# Altium schematic sheet Barrier_SchematicV2.SchDoc: Barrier Prj.
size A4; CompanyName: Pasargad-Barrier_Prj; Engineer: Pouya_Mn; Revision: 2
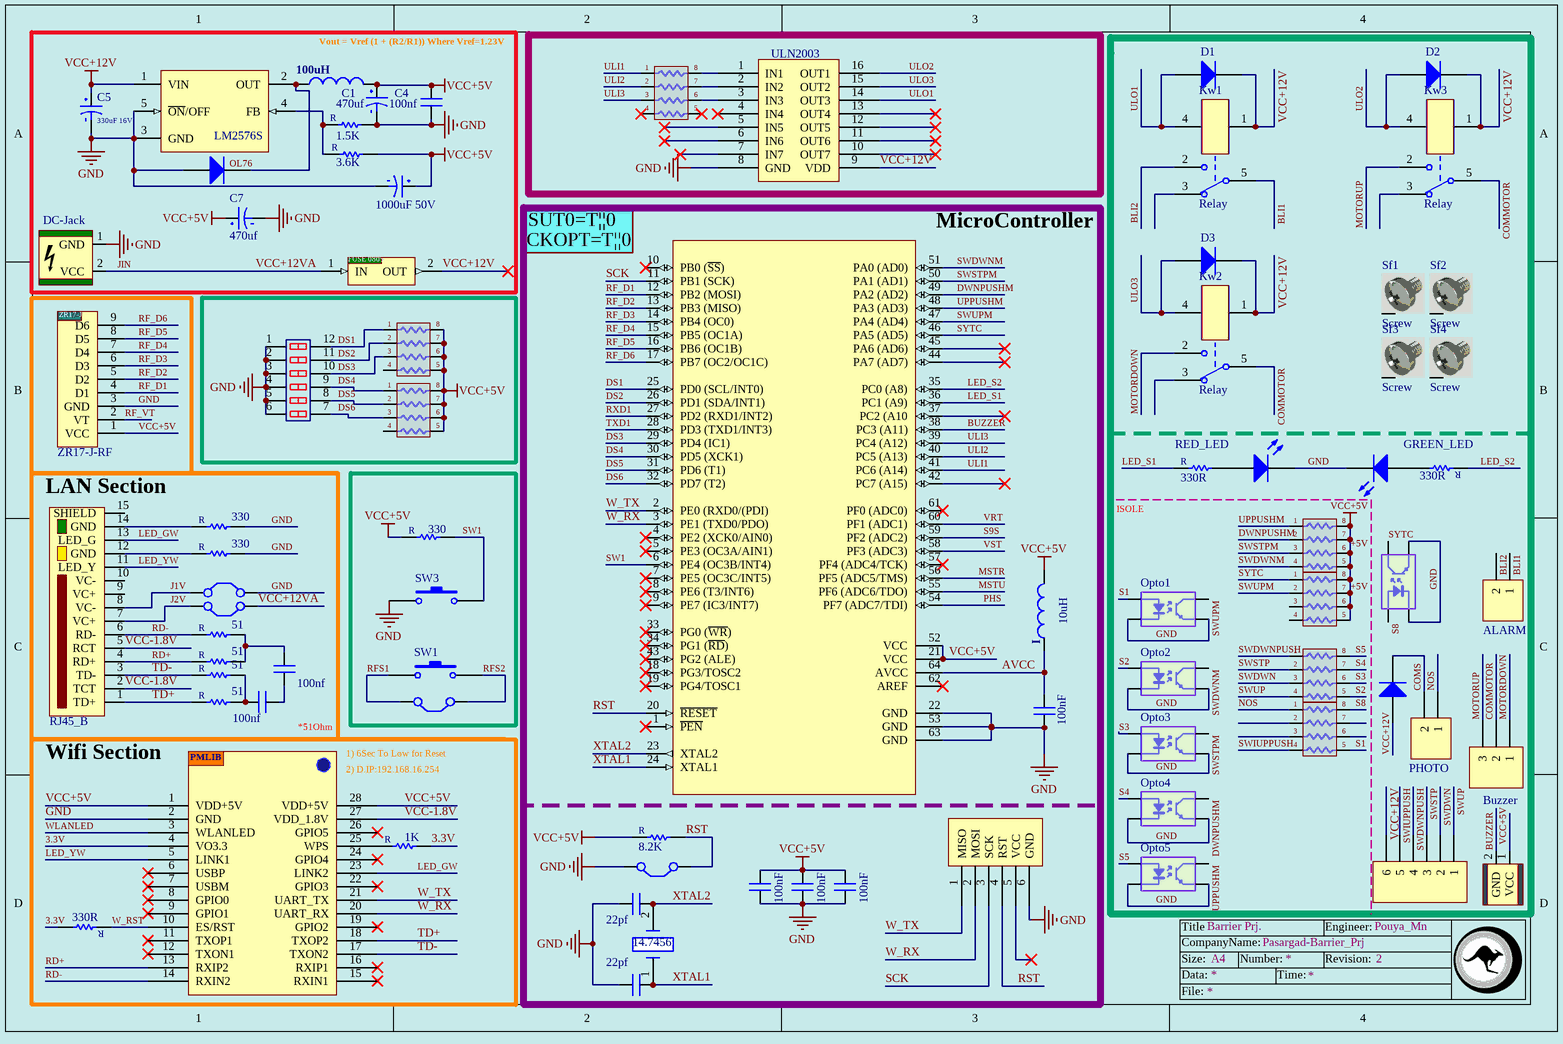
[diagram p0: Barrier_SchematicV2.SchDoc]

## Parts
3  HLK_WifiModule  [HLK]  (value not drawn)
7  10uH  [Indicator0805]
11  8.2K  [R0805]
15  Programmer  [Programmer]  (value not drawn)
17  330R  [R0805]
19  330R  [R0805]
34  330  [R0805]
35  330R  [R0805]
43  330  [R0805]
58  ZR17-J-RF  [ZR17-J]
78A  fuse_SMD0805  [fuse_SMD0805]  (value not drawn)
89  RJ45_B  [RJ45_B]
852  LM2576S  [LM2576S]
2323  Jumper  [Jumper]  (value not drawn)
?  t  [DIPSW6]  (value not drawn)
B  Buzzer  [Buzzer]
C1  470uf  [2220]
C4  100nf  [Cap0805]
C5  Cap_4mm  [Cap_4mm]  (value not drawn)
C7  470uf  [2220]
C8  100nF  [Cap0805]
C9  22pf  [Cap0805]
C10  22pf  [Cap0805]
C18  Cap_5mm  [Cap_5mm]  (value not drawn)
C87  100nF  [Cap0805]
C88  100nF  [Cap0805]
C89  100nF  [Cap0805]
C93  100nf  [Cap0805]
C94  100nf  [Cap0805]
D1  (no value)  [Diod-1A-SMD]
D1-2  (no value)  [Diod-1A-SMD]
D2  (no value)  [Diod-1A-SMD]
D3  (no value)  [Diod-1A-SMD]
DG  (no value)  [Diod-1A-SMD]
DSDF  DC-Jack  [DC_powerjack]
F4  Res0603 Array  [Res 0603 Array]  (value not drawn)
F5  Res0603 Array  [Res 0603 Array]  (value not drawn)
fdcg  Jumper  [Jumper]  (value not drawn)
fdcg3WW  Jumper  [Jumper]  (value not drawn)
fdcg30  Jumper  [Jumper]  (value not drawn)
GREEN_LED  LED_SMD  [Led0805]  (value not drawn)
H7  330  [R0805]
HGT  PHOTO  [Phonix-2]
HGTd  ALARM  [Phonix-2]
I1-1  Indicator100uH  [Indicator_SMD]  (value not drawn)
Kw1  Relay  [RelayMiniHJR6PIN]
Kw2  Relay  [RelayMiniHJR6PIN]
Kw3  Relay  [RelayMiniHJR6PIN]
Opto1  Optoisolator(smd)  [OptoCupler]  (value not drawn)
Opto1f  Optoisolator(smd)  [OptoCupler]  (value not drawn)
Opto2  Optoisolator(smd)  [OptoCupler]  (value not drawn)
Opto3  Optoisolator(smd)  [OptoCupler]  (value not drawn)
Opto4  Optoisolator(smd)  [OptoCupler]  (value not drawn)
Opto5  Optoisolator(smd)  [OptoCupler]  (value not drawn)
PO  51  [R0805]
POS  51  [R0805]
POS2  51  [R0805]
POS3  51  [R0805]
POSWW  1K  [R0805]
R1-1-1  1.5K  [R0805]
R-1-1-2  3.6K  [R0805]
RaD  Res0603 Array  [Res 0603 Array]  (value not drawn)
RaDd  Res0603 Array  [Res 0603 Array]  (value not drawn)
RaDdc  Res0603 Array  [Res 0603 Array]  (value not drawn)
RaDds  Res0603 Array  [Res 0603 Array]  (value not drawn)
RaDds3  Res0603 Array  [Res 0603 Array]  (value not drawn)
RED_LED  LED_SMD  [Led0805]  (value not drawn)
Sf1  Screw  [Screw]
Sf2  Screw  [Screw]
Sf3  Screw  [Screw]
Sf4  Screw  [Screw]
SW1  PushButton_small  [PushButton]  (value not drawn)
SW3  PushButton_small  [PushButton]  (value not drawn)
Tmotor  Phonix  [Phonix-3]  (value not drawn)
TYN  Phonix  [Phonix-6]  (value not drawn)
U1  ATmega64-16AU  [64A_N]  (value not drawn)
WR  ULN2003  [SO16]
Y  14.7456  [CrystallB]

## Blocks framed on the sheet
Vout = Vref (1 + (R2/R1)) Where Vref=1.23V: 78A 852 C1 C4 C5 C7 C18 D1-2 DSDF I1-1 R1-1-1 R-1-1-2
MicroController: 7 11 15 C8-C10 C87-C89 fdcg30 U1 Y
Wifi Section: 3 35 POSWW

## Nets
+5V: 3.1(VDD+5V) 3.28(VDD+5V) 7.2 11.2 58.1(VCC) B.1(VCC) C1.2 C4.2 C7.2 C18.2 C87.2 C88.2 C89.2 H7.2 I1-1.2 R-1-1-2.1 RaD.5 RaD.6 RaD.7 RaD.8 RaDd.5 RaDd.6 RaDd.7 RaDd.8 RaDds.5 RaDds.6 RaDds.7 RaDds.8 RaDds3.5 RaDds3.6 RaDds3.7 RaDds3.8 U1.21(VCC) U1.52(VCC)  [also labelled VCC+5V]
GND: 3.2(GND) 15.6(GND) 34.1 43.1 58.3(GND) 852.3(GND) 852.5(~{ON}/OFF) ?.1 ?.2 ?.3 ?.4 ?.5 ?.6 C1.1 C4.1 C5.1 C7.1 C8.1 C9.2 C10.2 C18.1 C87.1 C88.1 C89.1 D1-2.A DSDF.1(GND) fdcg.2(C2) fdcg30.2(C2) GREEN_LED.K Opto1.2(K) Opto1.3(E) Opto1f.2(K) Opto1f.3(E) Opto2.2(K) Opto2.3(E) Opto3.2(K) Opto3.3(E) Opto4.2(K) Opto4.3(E) Opto5.2(K) Opto5.3(E) R1-1-1.1 RED_LED.K SW3.1 U1.22(GND) U1.53(GND) U1.63(GND) WR.8(GND)
VCC+12V: 78A.2(OUT) 852.1(VIN) C5.2 D1.K D2.K D3.K DG.A Kw1.1 Kw2.1 Kw3.1 TYN.6 WR.9(VDD)
3.3V: 3.4(VO3.3) 35.1 POSWW.1
AVCC: 7.1 C8.2 U1.64(AVCC)
BLI1: HGTd.1 Kw1.5
BLI2: HGTd.2 Kw1.2
BUZZER: B.2(GND) U1.38(PC3_(A11))
COMMOTOR: Kw2.5 Kw3.5 Tmotor.2
COMS: DG.K HGT.2
DS1: ?.12 RaD.1 U1.25(PD0_(SCL/INT0))
DS2: ?.11 RaD.2 U1.26(PD1_(SDA/INT1))
DS3: ?.10 RaD.3 U1.29(PD4_(IC1))
DS4: ?.9 RaDd.1 U1.30(PD5_(XCK1))
DS5: ?.8 RaDd.2 U1.31(PD6_(T1))
DS6: ?.7 RaDd.3 U1.32(PD7_(T2))
DWNPUSHM: Opto4.4(C) RaDds.2 U1.49(PA2_(AD2))
J1V: 89.8(VC-) fdcg.1(C1)
J2V: 89.7(VC+) 2323.2(C2)
JIN: 78A.1(IN) 2323.1(C1) DSDF.2(VCC)  [also labelled VCC+12VA]
LED_GW: 3.23(LINK2) 89.13(LED_G)
LED_S1: 17.2 U1.36(PC1_(A9))
LED_S2: 19.2 U1.35(PC0_(A8))
LED_YW: 3.5(LINK1) 89.11(LED_Y)
MOTORDOWN: Kw2.2 Tmotor.1
MOTORUP: Kw3.2 Tmotor.3
MSTR: U1.56(PF5_(ADC5/TMS))
MSTU: U1.55(PF6_(ADC6/TDO))
NOS: F4.1 HGT.1
PHS: U1.54(PF7_(ADC7/TDI))
RD+: 3.13(RXIP2) 89.4(RD+) POS3.2
RD-: 3.14(RXIN2) 89.6(RD-) POS2.2
RF_D1: 58.4(D1) U1.12(PB2_(MOSI))
RF_D2: 58.5(D2) U1.13(PB3_(MISO))
RF_D3: 58.6(D3) U1.14(PB4_(OC0))
RF_D4: 58.7(D4) U1.15(PB5_(OC1A))
RF_D5: 58.8(D5) U1.16(PB6_(OC1B))
RF_D6: 58.9(D6) U1.17(PB7_(OC2/OC1C))
RF_VT: 58.2(VT)
RFS1: fdcg3WW.2(C2) SW1.1
RFS2: fdcg3WW.1(C1) SW1.2
RST: 11.1 15.4(RST) fdcg30.1(C1) U1.20(~{RESET})
RXD1: U1.27(PD2_(RXD1/INT2))
S1: F4.5 Opto1.1(A)
S2: F5.5 Opto2.1(A)
S3: F5.6 Opto3.1(A)
S4: F5.7 Opto4.1(A)
S5: F5.8 Opto5.1(A)
S8: F4.8 Opto1f.1(A)
S9S: U1.59(PF2_(ADC2))
SCK: 15.3(SCK) U1.11(PB1_(SCK))
SW1: H7.1 SW3.2 U1.6(PE4_(OC3B/INT4))
SWDWN: F5.3 TYN.2
SWDWNM: Opto2.4(C) RaDds.4 U1.51(PA0_(AD0))
SWDWNPUSH: F5.1 TYN.4
SWIUPPUSH: F4.4 TYN.5
SWSTP: F5.2 TYN.3
SWSTPM: Opto3.4(C) RaDds.3 U1.50(PA1_(AD1))
SWUP: F5.4 TYN.1
SWUPM: Opto1.4(C) RaDds3.2 U1.47(PA4_(AD4))
SYTC: Opto1f.4(C) RaDds3.1 U1.46(PA5_(AD5))
TD+: 3.18(TXOP2) 89.1(TD+) PO.2
TD-: 3.17(TXON2) 89.3(TD-) POS.2
TXD1: U1.28(PD3_(TXD1/INT3))
ULI1: RaDdc.1 U1.41(PC6_(A14))
ULI2: RaDdc.2 U1.40(PC5_(A13))
ULI3: RaDdc.3 U1.39(PC4_(A12))
ULO1: D1.A Kw1.4 WR.14(OUT3)
ULO2: D2.A Kw3.4 WR.16(OUT1)
ULO3: D3.A Kw2.4 WR.15(OUT2)
UPPUSHM: Opto5.4(C) RaDds.1 U1.48(PA3_(AD3))
VCC-1.8V: 3.27(VDD_1.8V) 89.2(TCT) 89.5(RCT)
VRT: U1.60(PF1_(ADC1))
VST: U1.58(PF3_(ADC3))
W_RST: 3.10(ES/RST) 35.2
W_RX: 3.20(UART_RX) 15.2(MOSI) U1.3(PE1_(TXD0/PDO))
W_TX: 3.21(UART_TX) 15.1(MISO) U1.2(PE0_(RXD0/(PDI))
WLANLED: 3.3(WLANLED)
XTAL1: C10.1 U1.24(XTAL1) Y.1
XTAL2: C9.1 U1.23(XTAL2) Y.2
Net3_25: 3.25(WPS) POSWW.2
Net17_1: 17.1 RED_LED.A
Net19_1: 19.1 GREEN_LED.A
Net34_2: 34.2 89.14(GND)
Net43_2: 43.2 89.12(GND)
Net852_2: 852.2(OUT) D1-2.K I1-1.1
Net852_4: 852.4(FB) R1-1-1.2 R-1-1-2.2
NetC93_1: C93.1 C94.1
NetC93_2: C93.2 PO.1 POS.1
NetC94_2: C94.2 POS2.1 POS3.1
NetRaDdc_6: RaDdc.6 WR.3(IN3)
NetRaDdc_7: RaDdc.7 WR.2(IN2)
NetRaDdc_8: RaDdc.8 WR.1(IN1)

Not connected (* = marked no-connect by the designer): 3 6(USBP)* 7(USBM)* 8(GPIO0)* 9(GPIO1)* 11(TXOP1)* 12(TXON1)* 15(RXIN1)* 16(RXIP1)* 19(GPIO2)* 22(GPIO3)* 24(GPIO4)* 26(GPIO5)*; 15 5(VCC)*; 89 9(VC+) 10(VC-) 15(SHIELD); F4 2 3 6 7; Kw1 3; Kw2 3; Kw3 3; RaD 4; RaDd 4; RaDdc 4* 5*; RaDds3 3 4; Sf1 S; Sf2 S; Sf3 S; Sf4 S; U1 1(~{PEN})* 4(PE2_(XCK0/AIN0))* 5(PE3_(OC3A/AIN1))* 7(PE5_(OC3C/INT5))* 8(PE6_(T3/INT6))* 9(PE7_(IC3/INT7))* 10(PB0_(~{SS}))* 18(PG3/TOSC2)* 19(PG4/TOSC1)* 33(PG0_(~{WR}))* 34(PG1_(~{RD}))* 37(PC2_(A10)* 42(PC7_(A15))* 43(PG2_(ALE))* 44(PA7_(AD7))* 45(PA6_(AD6))* 57(PF4_(ADC4/TCK))* 61(PF0_(ADC0))* 62(AREF)*; WR 4(IN4)* 5(IN5)* 6(IN6)* 7(IN7)* 10(OUT7)* 11(OUT6)* 12(OUT5)* 13(OUT4)*

## Notes on the sheet
- (near U1) CKOPT=T||0
- SUT0=T||0
- (near 89) LAN Section
- ISOLE
- *51Ohm
- 1) 6Sec To Low for Reset
- (near 3) 2) D.IP:192.168.16.254
- Labels drawn without touching a wire or pin: OL76
- Title
- Size:
- Data:
- CompanyName:
- A4
- Number:
- Time:
- Revision:
- Engineer:
- File:
- (in symbol Cap_4mm) 330uF 16V
- (in symbol Cap_5mm) 1000uF 50V
- (in symbol fuse_SMD0805) FUSE 0805
- (in symbol HLK_WifiModule) PMLIB
- (in symbol Indicator100uH) 100uH
- (in symbol Indicator0805) I
- (in symbol R0805) R
- (in symbol ZR17-J-RF) ZR17-J

## Library data of the parts
7 = Indicator0805
11 17 19 34 35 43 H7 PO POS POS2 POS3 POSWW R1-1-1 R-1-1-2 = R0805
? = DipSwitch6pin
C1 C7 = Cap_4mm
C4 C8-C10 C87-C89 C93 C94 = Cap0805: surface mount capacitor (size 805)
D1 D1-2 D2 D3 DG = Diode 1N4001 SMD
HGT HGTd = Phonix-2
Kw1-Kw3 = RelayMilon
Tmotor = Phonix-3
TYN = Phonix-6
U1 = ATmega64-16AU: 8-bit AVR Microcontroller, 4.5-5.5V, 64KB Flash, 2KB EEPROM, 4KB SRAM, 64-pin TQFP, Industrial Grade (-40°C to 85°C), Pb-Free; DatasheetVersion: revQ, Jul-2010; PackageVersion: revC, Oct-2010; PackageReference: 64A; PackageDescription: 64-Pin Plastic Thin Profile Quad Flat Pack, 14 x 14 x 1.0 mm Body, 0.8 mm Pitch (TQFP); Code_JEDEC: MS-026-AEB; ComponentLink1Description: Manufacturer URL; ComponentLink1URL: http://www.atmel.com/; ComponentLink2Description: ATmega64(L)  Datasheet; ComponentLink2URL: http://www.atmel.com/dyn/resources/prod_documents/doc2490.pdf; ComponentLink3Description: ATmega64(L) Summary; ComponentLink3URL: http://www.atmel.com/dyn/resources/prod_documents/2490S.pdf
Y = Xtal 1